# EAGLE design drive_new2 (EAGLE 9.5.2)
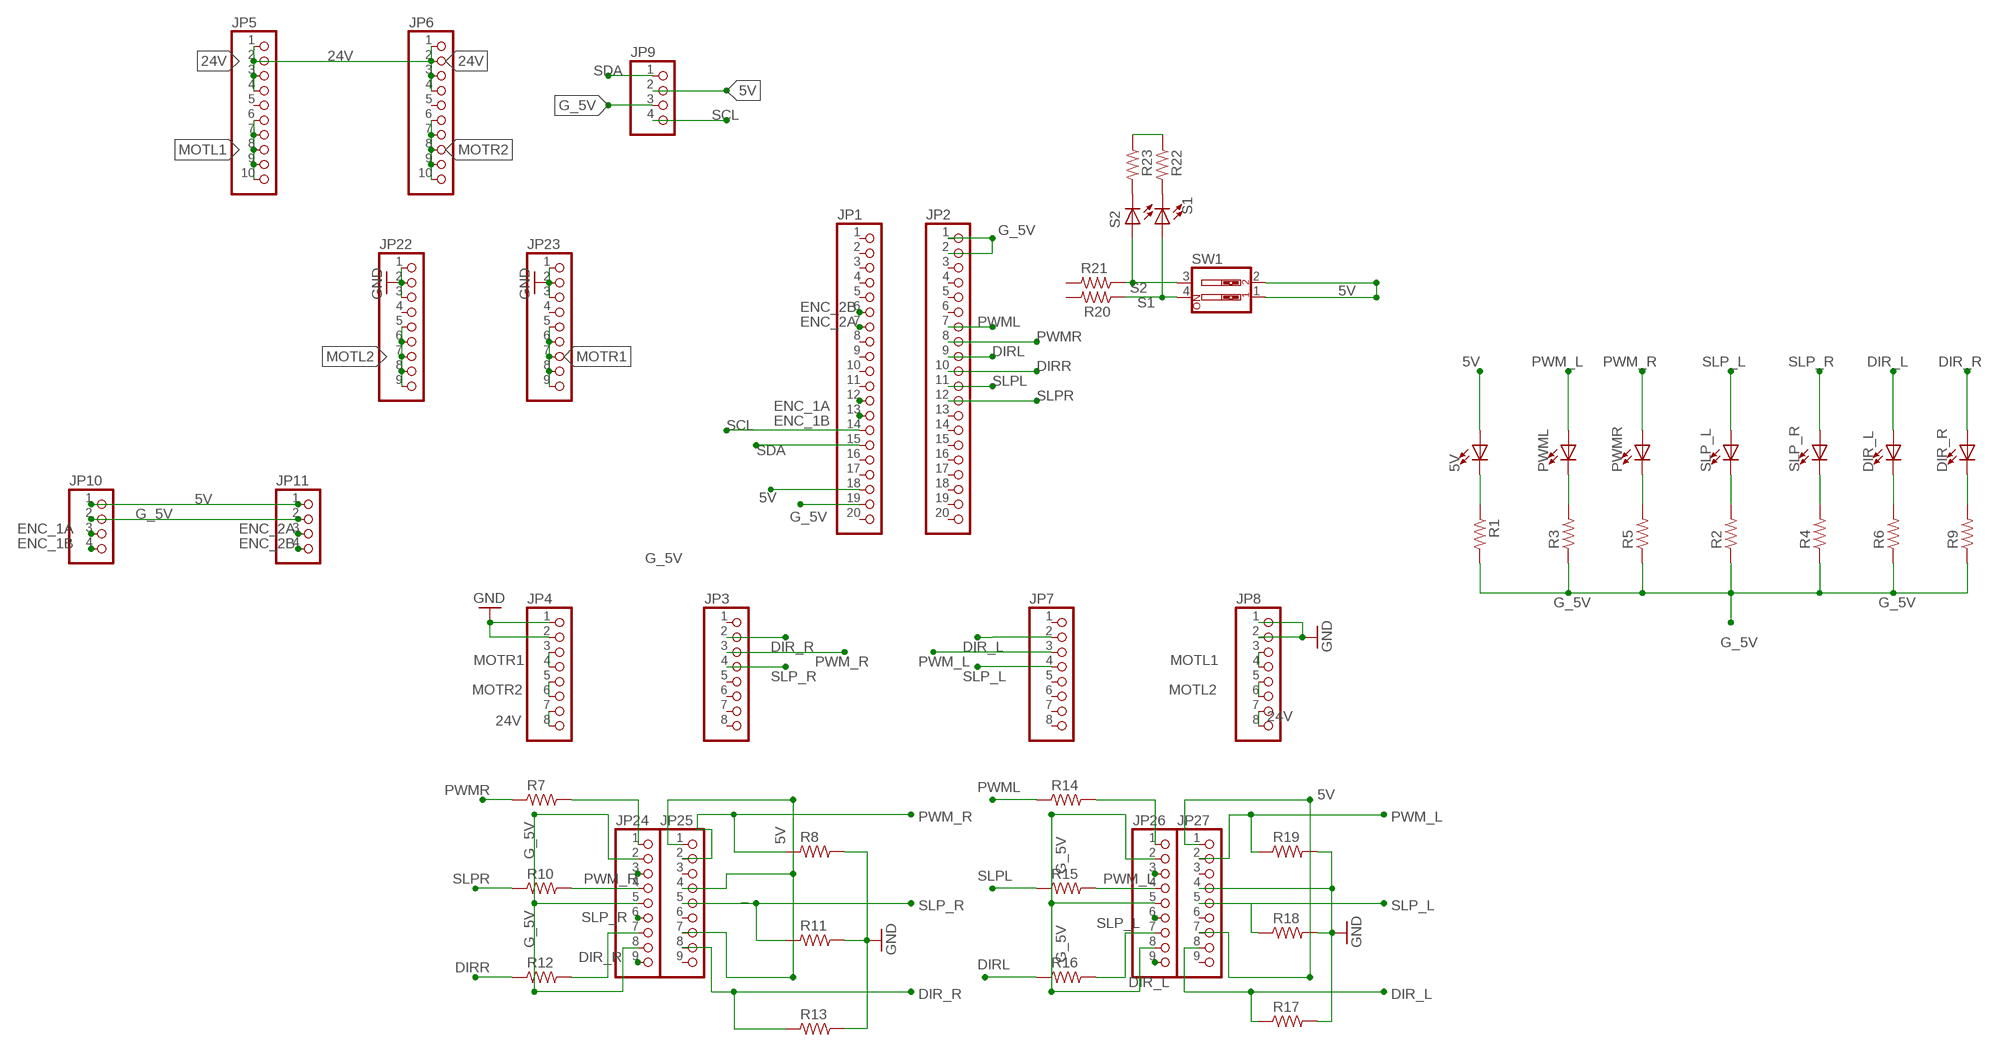
[diagram p0: schematic, sheet 1]

## Parts
5V  RED  LED_E  [LED_1206]
DIR_L  BLUE  LED_E  [LED_1206]
DIR_R  BLUE  LED_E  [LED_1206]
JP1  PINHD-1X20  [1X20]
JP2  PINHD-1X20  [1X20]
JP3  PINHD-1X8  [1X08]
JP4  PINHD-1X8  [1X08]
JP5  PINHD-1X10  [1X10]
JP6  PINHD-1X10  [1X10]
JP7  PINHD-1X8  [1X08]
JP8  PINHD-1X8  [1X08]
JP9  PINHD-1X4  [1X04]
JP10  PINHD-1X4  [1X04]
JP11  PINHD-1X4  [1X04]
JP22  PINHD-1X9  [1X09]
JP23  PINHD-1X9  [1X09]
JP24  PINHD-1X9  [1X09]
JP25  PINHD-1X9  [1X09]
JP26  PINHD-1X9  [1X09]
JP27  PINHD-1X9  [1X09]
PWML  RED  LED_E  [LED_1206]
PWMR  RED  LED_E  [LED_1206]
R1  R_0805  [R0805]
R2  R_0805  [R0805]
R3  R_0805  [R0805]
R4  R_0805  [R0805]
R5  R_0805  [R0805]
R6  R_0805  [R0805]
R7  R_0805  [R0805]
R8  R_0805  [R0805]
R9  R_0805  [R0805]
R10  R_0805  [R0805]
R11  R_0805  [R0805]
R12  R_0805  [R0805]
R13  R_0805  [R0805]
R14  R_0805  [R0805]
R15  R_0805  [R0805]
R16  R_0805  [R0805]
R17  R_0805  [R0805]
R18  R_0805  [R0805]
R19  R_0805  [R0805]
R20  R_0805  [R0805]
R21  R_0805  [R0805]
R22  R_0805  [R0805]
R23  R_0805  [R0805]
S1  RED  LED_E  [LED_1206]
S2  RED  LED_E  [LED_1206]
SLP_L  BLUE  LED_E  [LED_1206]
SLP_R  BLUE  LED_E  [LED_1206]
SW1  SW_DIP-2  [EDG-02]

## Nets
5V: 5V.A JP1.18 JP9.2 JP10.1 JP11.1 JP25.1 JP25.4 JP25.7 JP27.1 JP27.7 SW1.1 SW1.2
24V: JP4.7 JP4.8 JP5.1 JP5.2 JP5.3 JP5.4 JP6.1 JP6.2 JP6.3 JP6.4 JP8.7 JP8.8
DIR_L: DIR_L.A JP7.2 JP26.9 JP27.8 R17.1
DIR_R: DIR_R.A JP3.2 JP24.9 JP25.8 R13.1
DIRL: JP2.9 R16.1
DIRR: JP2.10 R12.1
ENC_1A: JP1.12 JP10.3
ENC_1B: JP1.13 JP10.4
ENC_2A: JP1.7 JP11.3
ENC_2B: JP1.6 JP11.4
G_5V: JP1.19 JP2.1 JP2.2 JP9.3 JP10.2 JP11.2 JP24.2 JP24.5 JP24.8 JP26.2 JP26.5 JP26.8 R1.2 R2.1 R3.1 R4.1 R5.1 R6.1 R9.1 R22.1 R23.1
GND: JP4.1 JP4.2 JP8.1 JP8.2 JP22.1 JP22.2 JP22.3 JP23.1 JP23.2 JP23.3 JP27.4 R8.2 R11.2 R13.2 R17.2 R18.2 R19.2
MOTL1: JP5.6 JP5.7 JP5.8 JP5.9 JP5.10 JP8.3 JP8.4
MOTL2: JP8.5 JP8.6 JP22.5 JP22.6 JP22.7 JP22.8 JP22.9
MOTR1: JP4.3 JP4.4 JP23.5 JP23.6 JP23.7 JP23.8 JP23.9
MOTR2: JP4.5 JP4.6 JP6.6 JP6.7 JP6.8 JP6.9 JP6.10
N$1: DIR_R.C R9.2
N$2: DIR_L.C R6.2
N$3: R4.2 SLP_R.C
N$4: R2.2 SLP_L.C
N$5: JP24.4 R10.2
N$6: JP26.4 R15.2
N$8: PWMR.C R5.2
N$9: PWML.C R3.2
N$10: 5V.C R1.1
N$11: JP24.1 R7.2
N$14: R22.2 S1.C
N$15: JP24.7 R12.2
N$16: R23.2 S2.C
N$19: JP26.1 R14.2
N$21: JP26.7 R16.2
PWM_L: JP7.3 JP26.3 JP27.2 PWML.A R19.1
PWM_R: JP3.3 JP24.3 JP25.2 PWMR.A R8.1
PWML: JP2.7 R14.1
PWMR: JP2.8 R7.1
S1: R20.1 S1.A SW1.4
S2: R21.1 S2.A SW1.3
SCL: JP1.14 JP9.4
SDA: JP1.15 JP9.1
SLP_L: JP7.4 JP26.6 JP27.5 R18.1 SLP_L.A
SLP_R: JP3.4 JP24.6 JP25.5 R11.1 SLP_R.A
SLPL: JP2.11 R15.1
SLPR: JP2.12 R10.1
Unconnected: JP1.1 JP1.2 JP1.3 JP1.4 JP1.5 JP1.8 JP1.9 JP1.10 JP1.11 JP1.16 JP1.17 JP1.20 JP2.3 JP2.4 JP2.5 JP2.6 JP2.13 JP2.14 JP2.15 JP2.16 JP2.17 JP2.18 JP2.19 JP2.20 JP3.1 JP3.5 JP3.6 JP3.7 JP3.8 JP5.5 JP6.5 JP7.1 JP7.5 JP7.6 JP7.7 JP7.8 JP22.4 JP23.4 JP25.3 JP25.6 JP25.9 JP27.3 JP27.6 JP27.9 R20.2 R21.2

## Library data of the parts
5V DIR_L DIR_R PWML PWMR S1 S2 SLP_L SLP_R = eagle-ltspice:LED_E: LED Source: http://www.osram.convergy.de Source: www.luxeon.com Source: www.kingbright.com; SPICEMODEL: NONE; SPICEPREFIX: D; SPICETYPE: diode
JP1 JP2 = pinhead:PINHD-1X20: PIN HEADER
JP3 JP4 JP7 JP8 = pinhead:PINHD-1X8: PIN HEADER
JP5 JP6 = pinhead:PINHD-1X10: PIN HEADER
JP9-JP11 = pinhead:PINHD-1X4: PIN HEADER
JP22-JP27 = pinhead:PINHD-1X9: PIN HEADER
R1-R23 = rc-master-smd:R_: RESISTOR
SW1 = special:SW_DIP-2: DIP SWITCH

## Board
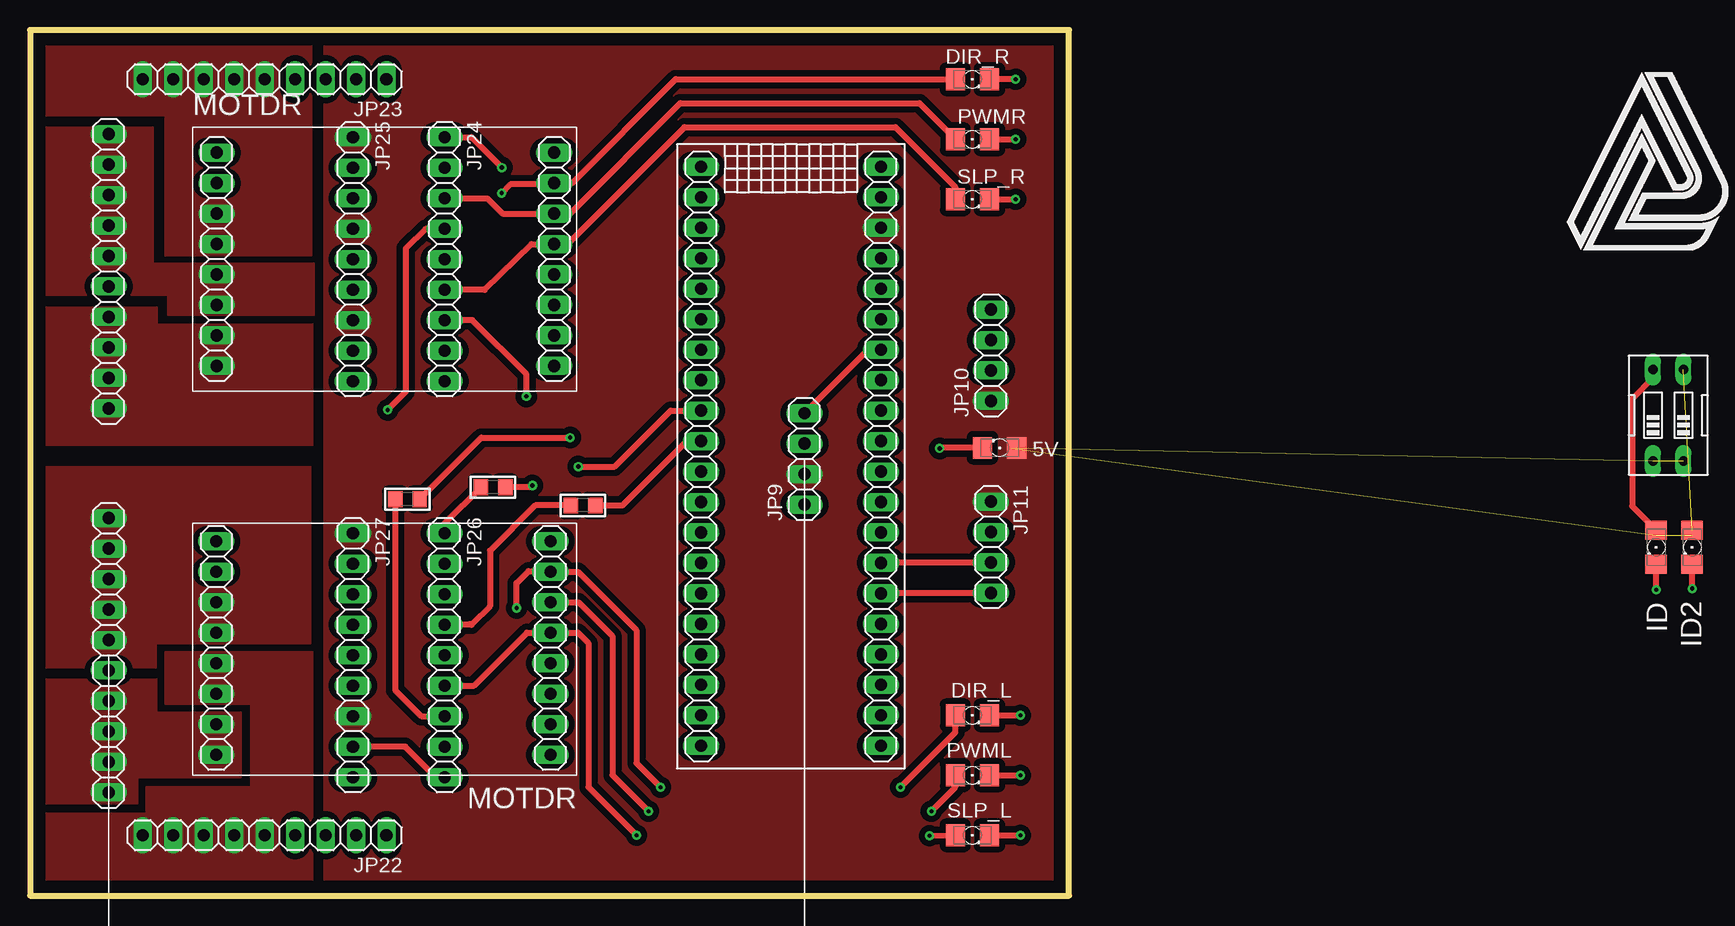
[diagram p1: board, top side]
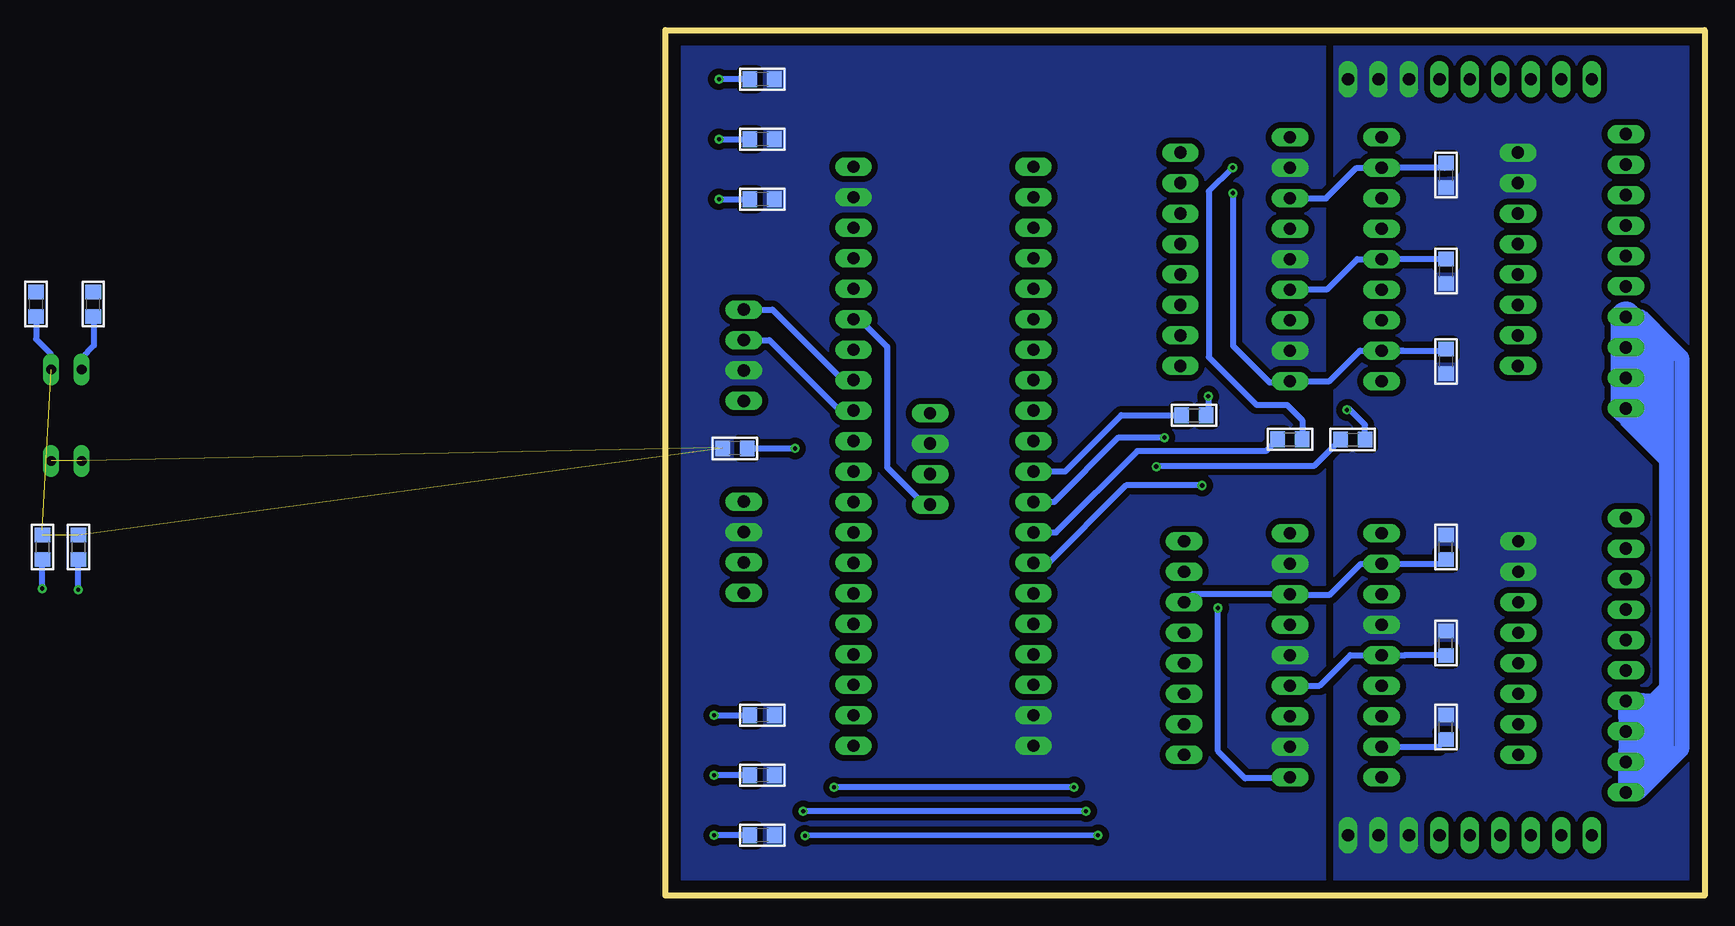
[diagram p2: board, bottom side, seen from below]

Size 86.61 x 72.14 mm. Coordinates in mm from the lower left corner, seen from the top.
Outline: 0,0 86.61,0 86.61,72.14 0,72.14 0,0
Copper layers (1*16): Top 0.035mm / dielectric 1.5mm / Bottom 0.035mm
Design rules "default *": minimum track width 6mil, minimum drill 0.35mm, track to track 20mil, track to pad 20mil, pad to pad 20mil, via to via 20mil, smd to smd 20mil, copper to edge 40mil, drill to drill 6mil, minimum pad ring 10mil, minimum via ring 8mil, stop-mask expansion 4mil, vias tented up to drill 0mil, thermal gap 10mil

### Footprints (pad centres in the part's own frame; a part is rotated, then mirrored left to right if it is on the bottom)
LED_1206 = smd 1.6 x 1.803: A -1.422,0; C 1.422,0
1X20 = drill 1.016 long: 1 -24.13,0; 2 -21.59,0; 3 -19.05,0; 4 -16.51,0; 5 -13.97,0; 6 -11.43,0; 7 -8.89,0; 8 -6.35,0; 9 -3.81,0; 10 -1.27,0; 11 1.27,0; 12 3.81,0; 13 6.35,0; 14 8.89,0; 15 11.43,0; 16 13.97,0; 17 16.51,0; 18 19.05,0; 19 21.59,0; 20 24.13,0
1X08 = drill 1.016 long: 1 -8.89,0; 2 -6.35,0; 3 -3.81,0; 4 -1.27,0; 5 1.27,0; 6 3.81,0; 7 6.35,0; 8 8.89,0
1X10 = drill 1.016 long: 1 -11.43,0; 2 -8.89,0; 3 -6.35,0; 4 -3.81,0; 5 -1.27,0; 6 1.27,0; 7 3.81,0; 8 6.35,0; 9 8.89,0; 10 11.43,0
1X04 = drill 1.016 long: 1 -3.81,0; 2 -1.27,0; 3 1.27,0; 4 3.81,0
1X09 = drill 1.016 long: 1 -10.16,0; 2 -7.62,0; 3 -5.08,0; 4 -2.54,0; 5 0,0; 6 2.54,0; 7 5.08,0; 8 7.62,0; 9 10.16,0
R0805 = smd 1.2 x 1.3: 1 -1.016,0; 2 1.016,0
EDG-02 = drill 0.813 long: 1 -1.27,-3.81; 2 1.27,-3.81; 3 1.27,3.81; 4 -1.27,3.81

### Placement (x,y rotation side)
5V  80.83,37.32 180 top
DIR_L  78.56,15.03 0 top
DIR_R  78.56,68.03 0 top
JP1  70.94,36.61 90 top
JP2  55.94,36.61 90 top
JP3  43.7,53.03 270 top
JP4  15.56,53.03 270 top
JP5  6.56,20.03 90 top
JP6  6.56,52.03 90 top
JP7  43.39,20.64 270 top
JP8  15.53,20.64 270 top
JP9  64.56,36.4 90 top
JP10  80.1,45.03 90 top
JP11  80.1,29.03 270 top
JP22  19.56,5.03 180 top
JP23  19.56,68.03 180 top
JP24  34.56,53.03 270 top
JP25  26.92,53.03 270 top
JP26  34.56,20.03 270 top
JP27  26.92,20.03 270 top
PWML  78.56,10.03 0 top
PWMR  78.56,63.03 0 top
R1  80.83,37.27 180 bottom
R2  78.56,5.03 180 bottom
R3  78.56,10.03 180 bottom
R4  78.56,58.03 180 bottom
R5  78.56,63.03 180 bottom
R6  78.56,15.03 180 bottom
R7  34.56,38.03 0 bottom
R8  21.56,60.03 270 bottom
R9  78.56,68.03 180 bottom
R10  29.32,38.02 0 bottom
R11  21.56,52.03 270 bottom
R12  42.56,40.03 0 bottom
R13  21.56,44.52 270 bottom
R14  38.6,34.03 180 top
R15  46.1,32.52 180 top
R16  31.46,33.03 180 top
R17  21.56,14.03 90 bottom
R18  21.56,21.03 90 bottom
R19  21.56,29.03 90 bottom
R20  134.32,49.29 90 bottom  (outside the outline)
R21  139.08,49.29 90 bottom  (outside the outline)
R22  135.56,29.03 270 bottom  (outside the outline)
R23  138.56,29.03 270 bottom  (outside the outline)
S1  135.56,29.03 270 top  (outside the outline)
S2  138.56,29.03 270 top  (outside the outline)
SLP_L  78.56,5.03 0 top
SLP_R  78.56,58.03 0 top
SW1  136.56,40.03 0 top  (outside the outline)

### Tracks (layer width: path | path; a pad name or v marks a point on that pad's centre or on a via)
5V  (2 unrouted)
  pour Top (no thermals): 24.56,75.84 90.91,75.84 90.91,-3.95 24.56,-3.95
24V
  Bottom 1.27: JP5.1 3.17,11.98 3.17,13.46 | 3.17,43.94 3.17,42.67 | 3.17,42.67 3.17,41.4 | 3.17,41.4 3.17,38.86 | 3.17,38.86 3.17,37.59 | 3.17,37.59 3.17,36.32 | 3.17,36.32 3.17,17.27 | 3.17,17.27 3.17,16 | 3.17,16 3.17,14.73 | 3.17,14.73 3.17,13.46 | JP6.1 4.03,40.6 3.56,40.13 | JP6.3 3.55,42.67 3.17,42.67 | JP6.2 3.56,40.14 3.56,40.13 | 3.17,41.4 5.71,43.94 6.1,43.94 | 3.17,43.94 5.71,46.48 6.56,46.48 | JP6.1 3.55,37.59 3.17,37.59 | JP6.1 6.09,40.13 3.56,40.13 | JP6.1 4.82,38.86 3.17,38.86 | JP6.1 6.56,39.7 3.17,36.32 | JP6.4 6.1,48.22 | 6.1,48.22 5.3,48.22 3.17,46.1 | 3.17,46.1 3.17,43.94 | 3.17,46.1 3.98,46.1 6.1,48.22 | 3.17,46.1 1.91,44.83 1.91,12.19 5.5,8.6 JP5.1 | JP5.1 6.56,12.19 | 6.56,14.73 6.56,12.19 | 6.56,14.73 6.56,16 | 6.56,16 JP5.4 | JP5.2 5.5,11.14 | 5.5,11.14 4.63,12 | 4.63,12 3.17,13.46 | JP5.3 4.22,13.68 3.17,14.73 | JP5.4 4.83,16.22 | 4.83,16.22 4.22,16.22 3.17,17.27 | 3.17,16 4,15.18 | 4,15.18 4.45,14.73 6.1,14.73 | 4.83,16.22 5.05,16 6.56,16 | 6.56,12.19 6.37,12 4.63,12 | 6.56,12.19 6.1,12.19 4.83,13.46 6.1,14.73 | 6.1,14.73 6.56,14.73 | 4,15.18 5.05,16.22 JP5.4 | JP5.1 5.5,9.66 5.5,11.14
  Bottom 2.54: JP6.4 6.56,46.48 JP6.1
  pour Top (no thermals): -1.16,18.03 10.52,18.03 10.52,15.3 17.56,15.3 17.56,9.83 8.95,9.83 8.95,7.68 -1.16,7.68
  pour Top (no thermals): 10.56,47.63 23.53,47.63 23.53,37.52 0.75,37.52 0.75,49.03 10.56,49.03
DIR_L  (via drill 0.35)
  Top 0.508: v52.56,9.03 50.56,11.03 50.56,22.11 45.68,26.99 JP7.2 43.34,27.03 41.56,27.03 40.56,26.03 v40.56,23.97 | v72.56,9.03 77.13,13.61 DIR_L.A | 33.82,9.87 31.28,12.41 JP27.8
  Top 0.61: JP26.9 33.82,9.87
  Bottom 0.508: 21.81,12.76 R17.1 22.16,12.41 JP27.8 | v52.56,9.03 v72.56,9.03 | 35.01,9.93 JP26.9 35.2,9.87 35.21,9.78 38.3,9.78 40.56,12.03 v40.56,23.97 40.56,24.03
  Bottom 0.61: 34.98,9.91 35.01,9.93
DIR_R  (via drill 0.35)
  Top 0.508: DIR_R.A 53.83,68.03 45.18,59.38 JP3.2 43.58,59.27 40.03,59.27 v39.31,58.55
  Bottom 0.508: v39.31,58.55 v39.3,58.55 39.3,45.81 36.27,42.78 34.65,42.78 JP24.9 31.26,42.87 28.72,45.41 JP25.8 | R13.1 21.68,45.41 JP25.8 | 25.15,45.41 JP25.8
DIRL  (via drill 0.35)
  Top 0.508: v45.03,38.17 37.61,38.17 R16.1
  Bottom 0.508: v45.03,38.17 45.04,38.18 48.84,38.18 54.22,32.8 JP2.9
DIRR
  Bottom 0.508: R12.1 48.63,40.03 53.32,35.34 JP2.10
ENC_1A
  Bottom 0.508: JP10.3 77.95,46.3 72.08,40.42 JP1.12
ENC_1B
  Bottom 0.508: JP10.4 77.7,48.84 71.82,42.96 JP1.13
ENC_2A
  Top 0.508: JP11.3 80.06,27.72 JP1.7
ENC_2B
  Top 0.508: JP11.4 80.06,25.18 JP1.6
G_5V  (2 unrouted)
  pour Bottom (no thermals): 31.67,77.75 31.67,-5.86 92.18,-5.86 92.18,77.75
GND
  pour Bottom (no thermals): 0.24,77.38 30.92,77.38 30.92,-2.76 0.24,-2.76
MOTL1
  pour Top (no thermals): -0.52,19.03 10.54,19.03 10.54,21.03 23.4,21.03 23.4,35.72 -0.52,35.72
MOTL2
  pour Top (no thermals): 11.27,20.29 11.27,15.99 18.4,15.99 18.4,9.03 9.68,9.03 9.68,6.83 -1.79,6.83 -1.79,-0.14 23.56,-0.14 23.56,20.29
MOTR1
  pour Top (no thermals): 11.26,53.35 23.48,53.35 23.48,74.48 -1.97,74.48 -1.97,65.03 11.26,65.03
MOTR2
  pour Top (no thermals): 0.11,64.03 10.23,64.03 10.23,52.68 23.65,52.68 23.65,48.36 11.54,48.36 11.54,50.03 0.11,50.03
N$1  (via drill 0.35)
  Top 0.508: v82.16,68.03 DIR_R.C
  Bottom 0.508: R9.2 v82.16,68.03
N$2  (via drill 0.35)
  Top 0.508: v82.56,15.03 v82.55,15.03 DIR_L.C
  Bottom 0.508: v82.56,15.03 R6.2
N$3  (via drill 0.35)
  Top 0.508: SLP_R.C v82.16,58.03
  Bottom 0.508: v82.16,58.03 R4.2
N$4  (via drill 0.35)
  Top 0.508: SLP_L.C v82.56,5.03
  Bottom 0.508: R2.2 v82.56,5.03
N$5  (via drill 0.35)
  Top 0.508: v29.81,40.48 31.33,42 31.33,53.94 32.97,55.57 JP24.4
  Bottom 0.508: R10.2 28.3,39.22 29.68,40.6 v29.81,40.48
N$6
  Top 0.508: R15.2 42.12,32.51 38.35,28.74 38.35,24.13 36.83,22.61 | 36.83,22.61 36.58,22.61 | 36.83,22.61 36.8,22.57 JP26.4
N$8  (via drill 0.35)
  Top 0.508: PWMR.C v82.16,63.03
  Bottom 0.508: v82.16,63.03 R5.2
N$9  (via drill 0.35)
  Top 0.508: PWML.C v82.56,10.03
  Bottom 0.508: R3.2 v82.56,10.03
N$10  (via drill 0.35)
  Top 0.508: v75.83,37.27 75.87,37.32 5V.C
  Bottom 0.508: R1.1 v75.83,37.27
N$11  (via drill 0.35)
  Top 0.508: v39.34,60.67 36.8,63.21 34.58,63.21 JP24.1
  Bottom 0.508: 33.53,38.29 R7.2 | v39.34,60.67 41.32,58.69 41.32,44.87 37.34,40.89 34.8,40.89 33.54,39.64 33.54,38.53
  Bottom 0.61: 33.54,38.53 R7.2
N$14  (via drill 0.35)
  Top 0.508: v135.56,25.48 S1.C
  Bottom 0.508: v135.56,25.48 R22.2
N$15  (via drill 0.35)
  Top 0.508: v41.38,41.61 41.38,43.45 36.87,47.95 JP24.7
  Bottom 0.508: 41.29,40.29 R12.2 41.38,40.2 v41.38,41.61
N$16  (via drill 0.35)
  Top 0.508: v138.56,25.59 S2.C
  Bottom 0.508: v138.56,25.59 R23.2
N$19
  Top 0.508: R14.2 34.54,30.98 34.54,30.21 JP26.1
N$21
  Top 0.508: R16.2 30.45,17.13 32.62,14.95 JP26.7
PWM_L  (via drill 0.35)
  Top 0.508: JP7.3 45.74,24.45 48.56,21.63 48.56,10.03 v51.56,7.03 | PWML.A 77.13,9.03 v75.13,7.03
  Bottom 0.508: 21.81,27.76 R19.1 21.92,27.65 JP27.2 28.67,27.65 31.29,25.03 35.48,25.03 JP26.3 42.72,25.11 JP7.3 | v51.56,7.03 v75.13,7.03
PWM_R
  Top 0.508: PWMR.A 74.13,66.03 54.19,66.03 45,56.84 JP3.3 39.38,56.84 38.11,58.11 JP24.3
  Bottom 0.508: 21.78,61.27 R8.1 21.56,60.76 21.67,60.65 JP25.2 29.01,60.65 31.55,58.11 JP24.3 | 42.63,56.84 JP3.3
PWML  (via drill 0.35)
  Top 0.508: v41.88,34.18 41.74,34.03 R14.1
  Bottom 0.508: v41.88,34.18 48.23,34.18 54.96,27.45 55.67,27.45 JP2.7
PWMR
  Bottom 0.508: R7.1 36.57,37.03 47.29,37.03 54.06,30.26 JP2.8
S1
  Top 0.508: SW1.4 135.29,43.1 133.56,41.37 133.56,32.45 S1.A
  Bottom 0.508: R20.1 134.27,48.22 134.27,45.86 135.29,44.84 SW1.4
S2  (1 unrouted)
  Bottom 0.508: SW1.3 137.83,45.11 139.08,46.37 R21.1
SCL
  Top 0.508: JP9.4 69.85,45.5 JP1.14
SDA
  Bottom 0.508: JP9.1 64.79,32.82 65.29,32.82 68.14,35.68 68.14,45.76 70.43,48.04 JP1.15
SLP_L  (via drill 0.35)
  Top 0.508: v50.56,5.03 46.56,9.03 46.56,21.03 45.68,21.91 JP7.4 41.43,21.91 37.02,17.49 JP26.6 | v74.98,5 SLP_L.A
  Bottom 0.508: 21.81,19.76 R18.1 25,20.02 25.02,20.03 JP27.5 29.54,20.03 32.08,17.49 JP26.6 | v50.56,5.03 v74.98,5
SLP_R
  Top 0.508: SLP_R.A 77.13,59.03 72.13,64.03 54.56,64.03 44.83,54.3 JP3.4 41.81,54.3 37.91,50.48 JP24.6
  Bottom 0.508: JP24.6 31.49,50.49 28.95,53.03 JP25.5 26.66,53.03 26.65,53.05 R11.1
SLPL
  Top 0.508: JP2.11 55.92,37.9 54.77,37.9 49.39,32.52 R15.1
SLPR  (via drill 0.35)
  Top 0.508: v45.71,35.76 v45.72,35.75 48.74,35.75 53.41,40.42 JP2.12
  Bottom 0.508: 30.32,38 R10.1 32.52,35.83 45.64,35.83 v45.71,35.76

### Text on the board
tNames: MOTDR | ID | ID2 | MOTDR